# Altium schematic sheet Main.SchDoc: [Untitled]
size A3; Author: Nędzny Janusz; CompanyName: SensDx S.A.; Organization: SensDx S.A.; Address1: Wrocław Laboratories; SheetNumber: 1; SheetTotal: 1
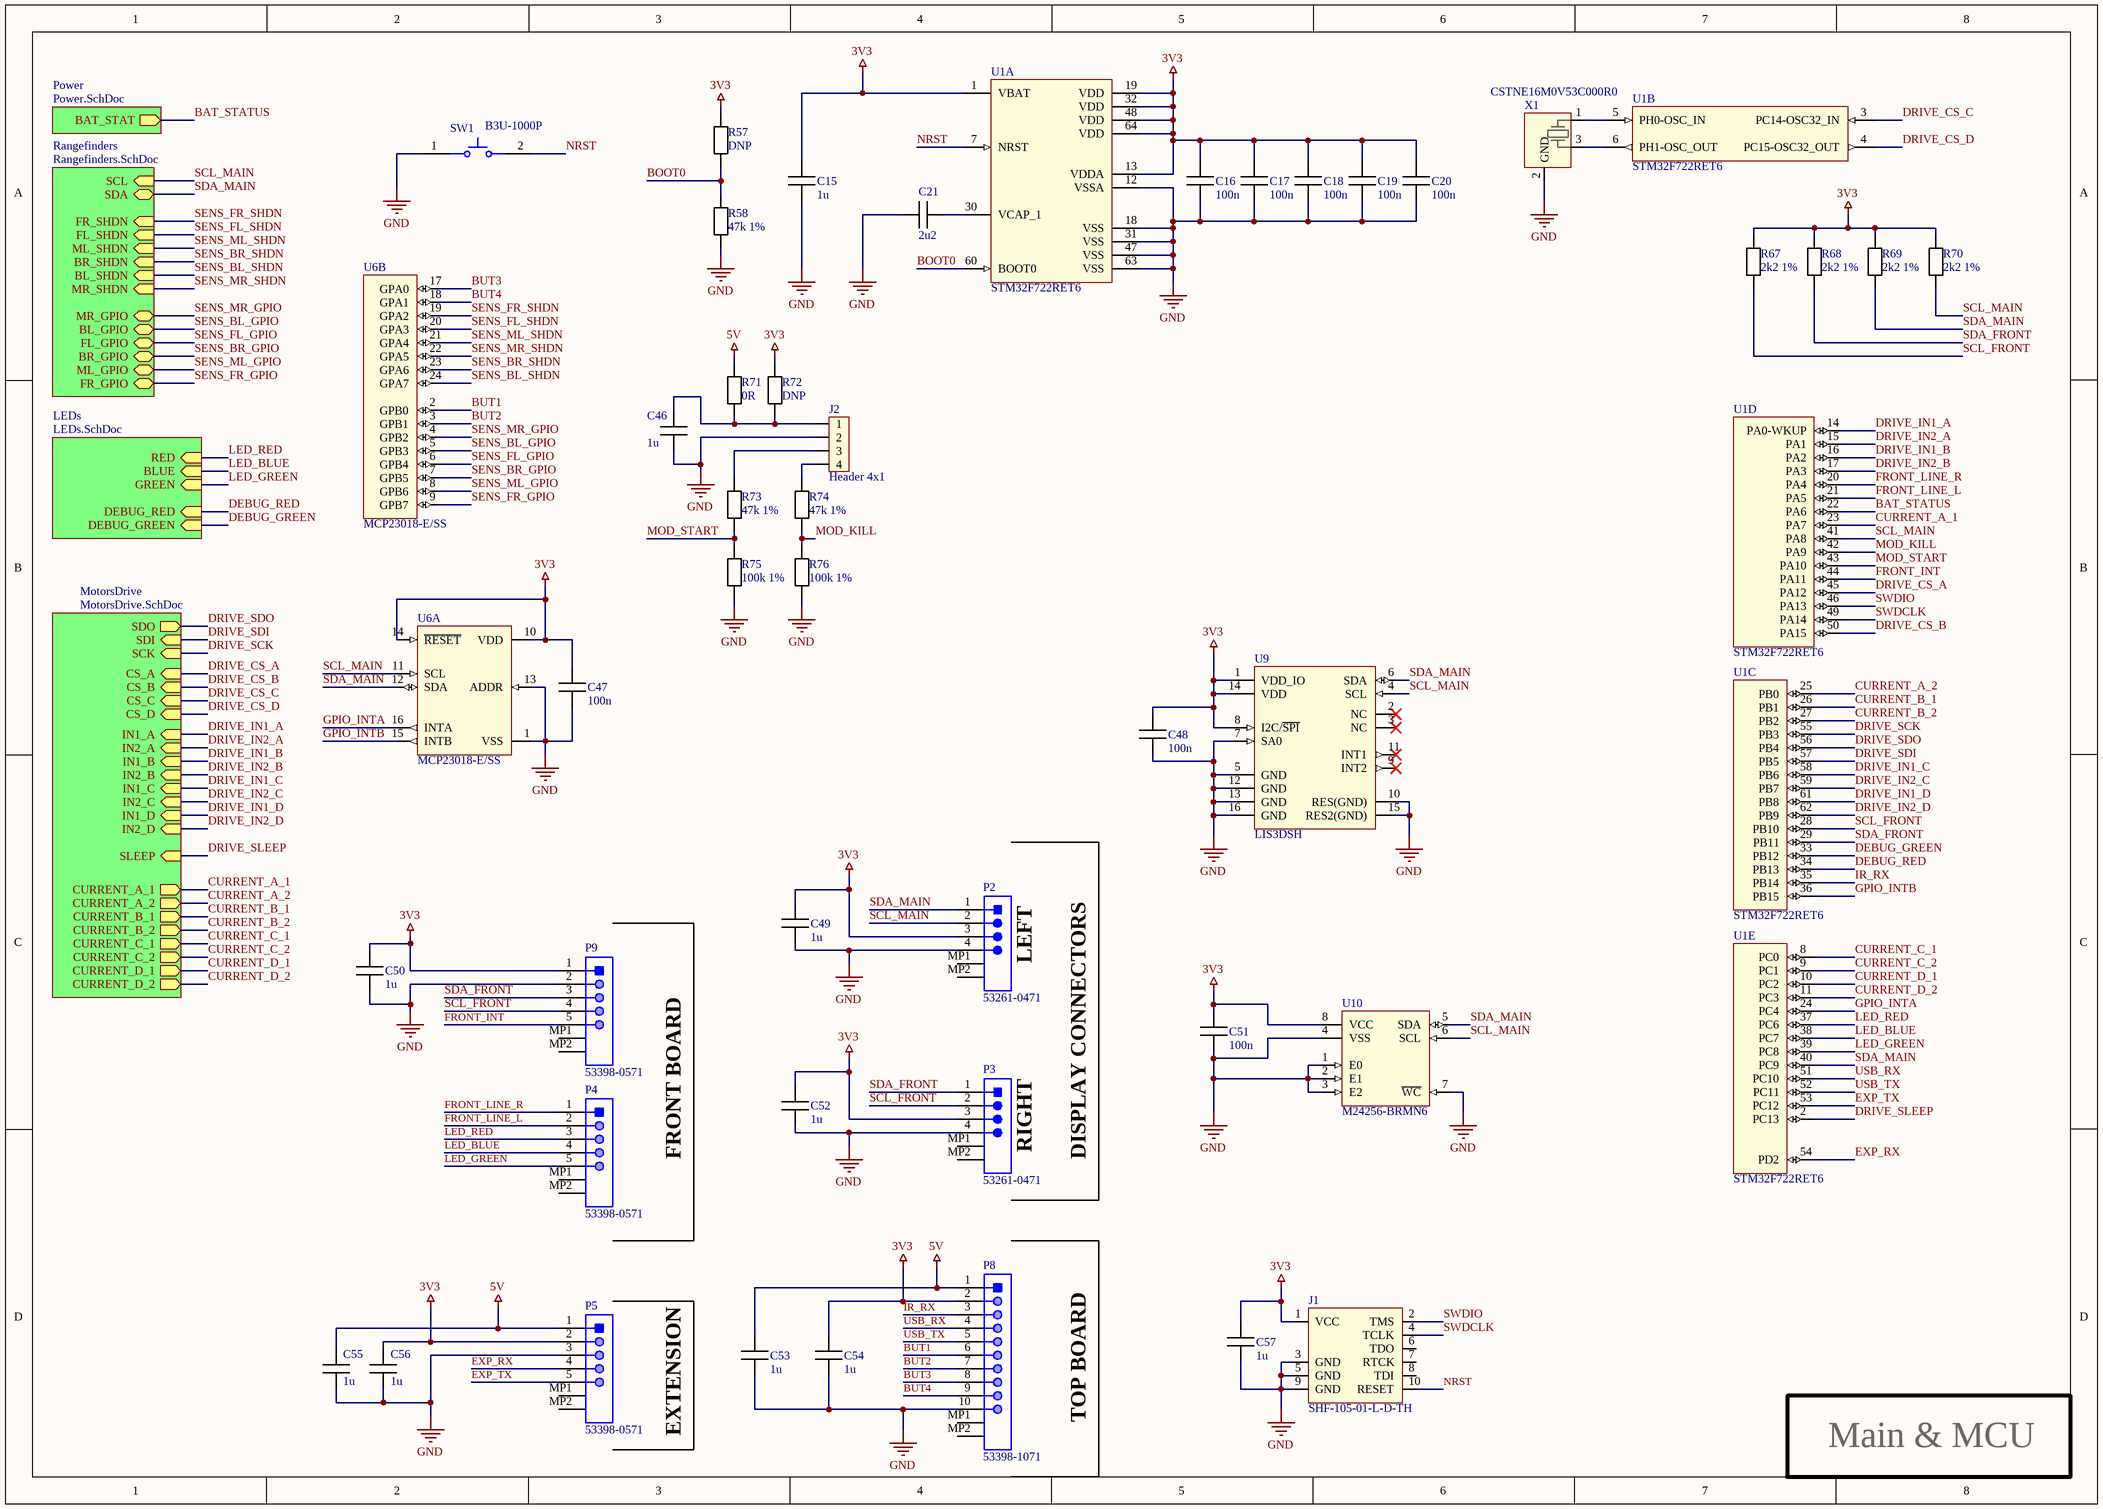
[diagram p0: Main.SchDoc]

## Parts
C15  1u  [C_0603_AUTO]
C16  100n  [C_0603_AUTO]
C17  100n  [C_0603_AUTO]
C18  100n  [C_0603_AUTO]
C19  100n  [C_0603_AUTO]
C20  100n  [C_0603_AUTO]
C21  2u2  [C_0603_AUTO]
C46  1u  [C_0603_AUTO]
C47  100n  [C_0603_AUTO]
C48  100n  [C_0603_AUTO]
C49  1u  [C_0603_AUTO]
C50  1u  [C_0603_AUTO]
C51  100n  [C_0603_AUTO]
C52  1u  [C_0603_AUTO]
C53  1u  [C_0603_AUTO]
C54  1u  [C_0603_AUTO]
C55  1u  [C_0603_AUTO]
C56  1u  [C_0603_AUTO]
C57  1u  [C_0603_AUTO]
J1  SHF-105-01-L-D-TH  [SHF-105-01-L-D-TH]
J2  Header 4x1  [F_4X1_254]
P2  53261-0471  [MOLEX-53261-0471_V]
P3  53261-0471  [MOLEX-53261-0471_V]
P4  53398-0571  [MOLX-53398-0571-5_V]
P5  53398-0571  [MOLX-53398-0571-5_V]
P8  53398-1071  [MOLX-53398-1071_V]
P9  53398-0571  [MOLX-53398-0571-5_V]
R57  DNP  [R_0603_AUTO]
R58  47k 1%  [R_0603_AUTO]
R67  2k2 1%  [R_0603_AUTO]
R68  2k2 1%  [R_0603_AUTO]
R69  2k2 1%  [R_0603_AUTO]
R70  2k2 1%  [R_0603_AUTO]
R71  0R  [R_0603_AUTO]
R72  DNP  [R_0603_AUTO]
R73  47k 1%  [R_0603_AUTO]
R74  47k 1%  [R_0603_AUTO]
R75  100k 1%  [R_0603_AUTO]
R76  100k 1%  [R_0603_AUTO]
SW1  B3U-1000P  [OMRON-B3U-1000_V]
U1  STM32F722RET6  [LQFP_64_HAND]  (parts A,B,C,D,E of 5)
U6  MCP23018-E/SS  [SSOP-24_HAND]  (parts A,B of 2)
U9  LIS3DSH  [LGA16_AUTO]
U10  M24256-BRMN6  [SOIC_8_AUTO]
X1  CSTNE16M0V53C000R0  [Murata_CSTCE]

## Sub-sheets
LEDs = LEDs.SchDoc: RED (in), BLUE (in), GREEN (in), DEBUG_RED (in), DEBUG_GREEN (in)
MotorsDrive = MotorsDrive.SchDoc: IN1_C (in), IN2_D (in), SLEEP (in), IN2_B (in), IN1_D (in), SDO (out), SCK (in), CS_D (in), SDI (in), CS_C (in), IN2_A (in), IN1_A (in), IN1_B (in), CS_B (in), IN2_C (in), CS_A (in), CURRENT_D_2 (out), CURRENT_D_1 (out), CURRENT_C_1 (out), CURRENT_B_2 (out), CURRENT_C_2 (out), CURRENT_A_2 (out), CURRENT_A_1 (out), CURRENT_B_1 (out)
Power = Power.SchDoc: BAT_STAT (out)
Rangefinders = Rangefinders.SchDoc: FR_SHDN (in), FR_GPIO (bidir), SCL (in), FL_SHDN (in), SDA (bidir), BL_GPIO (bidir), MR_GPIO (bidir), FL_GPIO (bidir), ML_SHDN (in), BR_SHDN (in), BR_GPIO (bidir), BL_SHDN (in), ML_GPIO (bidir), MR_SHDN (in)

## Nets
3V3: C15.2 C16.2 C17.2 C18.2 C19.2 C20.2 C47.2 C48.2 C49.2 C50.2 C51.2 C52.2 C54.2 C56.2 C57.2 J1.1(VCC) P2.3 P3.3 P5.2 P8.2 P9.1 R57.2 R67.2 R68.2 R69.2 R70.2 R72.2 U1.1(VBAT) U1.13(VDDA) U1.19(VDD) U1.32(VDD) U1.48(VDD) U1.64(VDD) U6.10(VDD) U6.14(~{RESET}) U9.1(VDD_IO) U9.8(I2C/~{SPI}) U9.14(VDD) U10.8(VCC)
5V: C53.2 C55.2 P5.1 P8.1 R71.2
GND: C15.1 C16.1 C17.1 C18.1 C19.1 C20.1 C21.2 C46.1 C47.1 C48.1 C49.1 C50.1 C51.1 C52.1 C53.1 C54.1 C55.1 C56.1 C57.1 J1.3(GND) J1.5(GND) J1.9(GND) J2.2 P2.4 P3.4 P5.3 P8.10 P9.2 R58.1 R75.1 R76.1 SW1.1 U1.12(VSSA) U1.18(VSS) U1.31(VSS) U1.47(VSS) U1.63(VSS) U6.1(VSS) U6.13(ADDR) U9.5(GND) U9.7(SA0) U9.10(RES(GND)) U9.12(GND) U9.13(GND) U9.15(RES2(GND)) U9.16(GND) U10.1(E0) U10.2(E1) U10.3(E2) U10.4(VSS) U10.7(~{WC}) X1.2(GND)
BAT_STATUS: U1.22(PA6) ; sheet Power/BAT_STAT
BOOT0: R57.1 R58.2 U1.60(BOOT0)
BUT1: P8.6 U6.2(GPB0)
BUT2: P8.7 U6.3(GPB1)
BUT3: P8.8 U6.17(GPA0)
BUT4: P8.9 U6.18(GPA1)
CURRENT_A_1: U1.23(PA7) ; sheet MotorsDrive/CURRENT_A_1
CURRENT_A_2: U1.25(PB0) ; sheet MotorsDrive/CURRENT_A_2
CURRENT_B_1: U1.26(PB1) ; sheet MotorsDrive/CURRENT_B_1
CURRENT_B_2: U1.27(PB2) ; sheet MotorsDrive/CURRENT_B_2
CURRENT_C_1: U1.8(PC0) ; sheet MotorsDrive/CURRENT_C_1
CURRENT_C_2: U1.9(PC1) ; sheet MotorsDrive/CURRENT_C_2
CURRENT_D_1: U1.10(PC2) ; sheet MotorsDrive/CURRENT_D_1
CURRENT_D_2: U1.11(PC3) ; sheet MotorsDrive/CURRENT_D_2
DEBUG_GREEN: U1.33(PB12) ; sheet LEDs/DEBUG_GREEN
DEBUG_RED: U1.34(PB13) ; sheet LEDs/DEBUG_RED
DRIVE_CS_A: U1.45(PA12) ; sheet MotorsDrive/CS_A
DRIVE_CS_B: U1.50(PA15) ; sheet MotorsDrive/CS_B
DRIVE_CS_C: U1.3(PC14-OSC32_IN) ; sheet MotorsDrive/CS_C
DRIVE_CS_D: U1.4(PC15-OSC32_OUT) ; sheet MotorsDrive/CS_D
DRIVE_IN1_A: U1.14(PA0-WKUP) ; sheet MotorsDrive/IN1_A
DRIVE_IN1_B: U1.16(PA2) ; sheet MotorsDrive/IN1_B
DRIVE_IN1_C: U1.58(PB6) ; sheet MotorsDrive/IN1_C
DRIVE_IN1_D: U1.61(PB8) ; sheet MotorsDrive/IN1_D
DRIVE_IN2_A: U1.15(PA1) ; sheet MotorsDrive/IN2_A
DRIVE_IN2_B: U1.17(PA3) ; sheet MotorsDrive/IN2_B
DRIVE_IN2_C: U1.59(PB7) ; sheet MotorsDrive/IN2_C
DRIVE_IN2_D: U1.62(PB9) ; sheet MotorsDrive/IN2_D
DRIVE_SCK: U1.55(PB3) ; sheet MotorsDrive/SCK
DRIVE_SDI: U1.57(PB5) ; sheet MotorsDrive/SDI
DRIVE_SDO: U1.56(PB4) ; sheet MotorsDrive/SDO
DRIVE_SLEEP: U1.2(PC13) ; sheet MotorsDrive/SLEEP
EXP_RX: P5.4 U1.54(PD2)
EXP_TX: P5.5 U1.53(PC12)
FRONT_INT: P9.5 U1.44(PA11)
FRONT_LINE_L: P4.2 U1.21(PA5)
FRONT_LINE_R: P4.1 U1.20(PA4)
GPIO_INTA: U1.24(PC4) U6.16(INTA)
GPIO_INTB: U1.36(PB15) U6.15(INTB)
IR_RX: P8.3 U1.35(PB14)
LED_BLUE: P4.4 U1.38(PC7) ; sheet LEDs/BLUE
LED_GREEN: P4.5 U1.39(PC8) ; sheet LEDs/GREEN
LED_RED: P4.3 U1.37(PC6) ; sheet LEDs/RED
MOD_KILL: R74.1 R76.2 U1.42(PA9)
MOD_START: R73.1 R75.2 U1.43(PA10)
NRST: J1.10(RESET) SW1.2 U1.7(NRST)
SCL_FRONT: P3.2 P9.4 R67.1 U1.28(PB10)
SCL_MAIN: P2.2 R70.1 U1.41(PA8) U6.11(SCL) U9.4(SCL) U10.6(SCL) ; sheet Rangefinders/SCL
SDA_FRONT: P3.1 P9.3 R68.1 U1.29(PB11)
SDA_MAIN: P2.1 R69.1 U1.40(PC9) U6.12(SDA) U9.6(SDA) U10.5(SDA) ; sheet Rangefinders/SDA
SENS_BL_GPIO: U6.5(GPB3) ; sheet Rangefinders/BL_GPIO
SENS_BL_SHDN: U6.24(GPA7) ; sheet Rangefinders/BL_SHDN
SENS_BR_GPIO: U6.7(GPB5) ; sheet Rangefinders/BR_GPIO
SENS_BR_SHDN: U6.23(GPA6) ; sheet Rangefinders/BR_SHDN
SENS_FL_GPIO: U6.6(GPB4) ; sheet Rangefinders/FL_GPIO
SENS_FL_SHDN: U6.20(GPA3) ; sheet Rangefinders/FL_SHDN
SENS_FR_GPIO: U6.9(GPB7) ; sheet Rangefinders/FR_GPIO
SENS_FR_SHDN: U6.19(GPA2) ; sheet Rangefinders/FR_SHDN
SENS_ML_GPIO: U6.8(GPB6) ; sheet Rangefinders/ML_GPIO
SENS_ML_SHDN: U6.21(GPA4) ; sheet Rangefinders/ML_SHDN
SENS_MR_GPIO: U6.4(GPB2) ; sheet Rangefinders/MR_GPIO
SENS_MR_SHDN: U6.22(GPA5) ; sheet Rangefinders/MR_SHDN
SWDCLK: J1.4(TCLK) U1.49(PA14)
SWDIO: J1.2(TMS) U1.46(PA13)
USB_RX: P8.4 U1.51(PC10)
USB_TX: P8.5 U1.52(PC11)
NetC21_1: C21.1 U1.30(VCAP_1)
NetC46_2: C46.2 J2.1 R71.1 R72.1
NetJ2_3: J2.3 R73.2
NetJ2_4: J2.4 R74.2
NetU1_5: U1.5(PH0-OSC_IN) X1.1
NetU1_6: U1.6(PH1-OSC_OUT) X1.3

Not connected (* = marked no-connect by the designer): J1 6(TDO) 7(RTCK) 8(TDI); P2 MP1 MP2; P3 MP1 MP2; P4 MP1 MP2; P5 MP1 MP2; P8 MP1 MP2; P9 MP1 MP2; U9 2(NC)* 3(NC)* 9(INT2)* 11(INT1)*

## Notes on the sheet
- (near P2) LEFT
- FRONT BOARD
- (near P3) RIGHT
- DISPLAY CONNECTORS
- EXTENSION
- TOP BOARD
- Main & MCU
- Title
- Size:
- Date:
- A3
- Number:
- Time:
- Revision:
- Sheet
- of
- File:

## Library data of the parts
C15-C21 C46-C57 = Capacitor: Manufacturer: [Generic]; MPN: [Generic]
  C15 C46 C49 C50 C52-C57: Value: 1u
  C16-C20 C47 C48 C51: Value: 100n
  C21: Value: 2u2
J1 = JTAG_ARM_MINI_10_PIN: Standard ARM 20 pin JTAG connector. Angle 90 deg.; Manufacturer: Samtec; Value: NA; MPN: SHF-105-01-L-D-TH; Supplier 1: Farnell; Supplier 2: Mouser; Supplier 3: Digi-Key; Supplier Part Number 1: 2308450; Supplier Part Number 2: 200-SHF10501LDTH; Supplier Part Number 3: SHF-105-01-L-D-TH-ND
J2 = Header 4x1: Manufacturer: NA; Value: NA; MPN: NA
P2 P3 = CMP-2000-05238-1: Male Header, Pitch 1.25 mm, 1 x 4 Position, Height 3.4 mm, -40 to 85 degC, RoHS, Tape and Reel; Current Rating: 1A; Brand: Molex; Number of Positions / Contacts: 4; Pitch: 1.25mm; Voltage Rating: 125V; Mounting Angle: Right; Manufacturer URL: http://www.molex.com/; Factory Pack Quantity: 1000; Housing Material: Thermoplastic; Datasheet URL: http://www.molex.com/pdm_docs/sd/532610471_sd.pdf; Tradename: PicoBlade; Product Type: Headers; Contact Plating: Tin; Contact Material: PhosphorBronze; Package Description: 1.25mm Pitch PicoBlade(TM) Header, Surface Mount, Right Angle, Lead-Free, 4 Circuits; Mounting Style: SMD/SMT; Manufacturer: Molex; Series: 53261; Packaging: Reel; Number of Rows: 1; RoHS: Details; Number of Positions: 4; Product Category: Headers&WireHousings; Datasheet Version: Rev. G, 01/2012; Type: Shrouded; Termination Style: SMD
P4 P5 P9 = CMP-2000-05250-1: Male Header, Pitch 1.25 mm, 1 x 5 Postion, Height 4.7 mm, -40 to 85 degC, RoHS, Tape and Reel; Brand: Molex; Number of Positions: 5Position; Mounting Angle: Vertical; Current Rating: 1A; Pitch: 1.25mm; Voltage Rating: 125V; Type: Shrouded; Tradename: PicoBlade; Datasheet Version: Rev. E, 04/2006; Housing Material: Nylon; Datasheet URL: http://www.molex.com/pdm_docs/sd/533980571_sd.pdf; Termination Style: SMD; Contact Gender: Pin(Male); Factory Pack Quantity: 1000; Number of Rows: 1Row; Product: Headers; Package Reference: MOLX-53398-0571-5; Contact Material: PhosphorBronze; RoHS: Details; Manufacturer URL: http://www.molex.com/; Product Category: Headers&WireHousings; Contact Plating: Tin; Manufacturer: Molex; Series: 53398; Packaging: Reel; Mounting Style: SMD
P8 = CMP-2000-05635-1: Male Header, Pitch 1.25 mm, 1 x 10 Position, Height 4.7 mm, -40 to 85 degC, RoHS, Tape and Reel; Manufacturer: Molex; Mounting Angle: Vertical; Pitch: 1.25mm; Voltage Rating: 125V; Current Rating: 1A; Number of Rows: 1Row; Housing Material: Nylon; Mounting Technology: SurfaceMount; Mounting Style: SMD; Contact Material: PhosphorBronze; Product: Headers; Datasheet URL: http://www.molex.com/pdm_docs/sd/533981071_sd.pdf; Manufacturer URL: http://www.molex.com/; Datasheet Version: Rev. J, 09/2015; Factory Pack Quantity: 1000; Brand: Molex; Packaging: Reel; Product Category: Headers&WireHousings; Contact Gender: Pin(Male); Number of Positions: 10Position; RoHS: Details; Contact Plating: Tin; Package Description: Male Header, Pitch 1.25 mm, 1 x 10 Position, Height 4.7 mm; Series: 53398; Type: Shrouded; Package Reference: 53398-1071; Tradename: PicoBlade; Termination Style: SMD
R57 R58 R67-R76 = Resistor: MPN: [Generic]; Manufacturer: [Generic]
  R57 R72: Value: DNP
  R58 R73 R74: Value: 47k 1%
  R67-R70: Value: 2k2 1%
  R71: Value: 0R
  R75 R76: Value: 100k 1%
SW1 = CMP-2100-03586-1: Ultra-Small Tactile Switch, 0.05 A, 12 V, -25 to 70 degC, 2-Pin SMD, RoHS, Tape and Reel; Manufacturer: Omron Electronic Components; Operating Force: 1.5N; Current Rating: 50mA; Voltage Rating (DC): 12V; Electrical Life: 200000Cycles; Actuator Length: 0.4mm; Insulation Resistance: 100MOhm; Switch Travel: 0.15mm; Throw Configuration: SPST; Illumination Type: Illuminated; Width: 3mm; Weight: 0.022g; Datasheet Version: 42005.0; Datasheet URL: http://www.omron.com/ecb/products/pdf/en-b3u.pdf; Height: 1.2mm; Package Quantity: 1; REACH SVHC: Unknown; Contact Current Rating: 50mA; Contact Material: Silver; Max Current Rating: 50mA; Package Reference: B3U-1000; Termination: SMD/SMT; Packaging: TapeandReel; Manufacturer URL: http://www.omron.com/; RoHSCompliant: true; Mount: SurfaceMount; Length: 4mm; Min Operating Temperature: -25degC; Depth: 2.5mm; Lead Free: LeadFree; Case/Package: SMD/SMT; Package Description: 2-Pin Surface Mount Device, Body 3 x 2.5 mm; Max Operating Temperature: 70degC; Orientation: Straight
U1 = STM32F722RET6: ST 32-bit MCU, 64-pin package; Manufacturer: STMicroelectronics; Value: NA; MPN: STM32F722RET6; ComponentLink1Description: Datasheet; ComponentLink1URL: https://www.st.com/resource/en/datasheet/stm32f722re.pdf; ComponentLink4Description: Product page; ComponentLink4URL: https://www.st.com/en/microcontrollers/stm32f722re.html; Supplier 3: Digi-Key; Supplier 2: Mouser; Supplier 1: Farnell; Supplier Part Number 1: 2725144; Supplier Part Number 2: 511-STM32F722RET6; Supplier Part Number 3: 497-17184-ND
U6 = MCP23018-E/SS: Expander I/O, 16-bit, 3.4 MHz, I2C, 1.8 V, 5.5 V, SSOP24; Manufacturer: Microchip; Value: NA; MPN: MCP23018-E/SS; ComponentLink1Description: Datasheet; ComponentLink1URL: http://ww1.microchip.com/downloads/en/DeviceDoc/22103a.pdf; ComponentLink2Description: Product page; ComponentLink2URL: https://www.microchip.com/wwwproducts/en/MCP23018
U9 = LIS3DSH: MEMS digital output motion sensor: / ultra-low-power high-performance three-axis "nano" accelerometer; Manufacturer: STMicroelectronics; Value: NA; MPN: LIS3DSH; ComponentLink1Description: Datasheet; ComponentLink1URL: https://www.st.com/resource/en/datasheet/lis3dsh.pdf; Supplier 1: Farnell; Supplier 2: Digi-Key; Supplier 3: Mouser; Supplier Part Number 1: 2433078; Supplier Part Number 3: 511-LIS3DSH; Supplier Part Number 2: LIS3DSH-ND
U10 = M24256-BRMN6: 256 Kbit Serial I2C Bus EEPROM; Manufacturer: STMicroelectronics; Value: 256kb; MPN: M24256-BRMN6; ComponentLink1Description: Datasheet; ComponentLink1URL: https://www.st.com/resource/en/datasheet/m24256-br.pdf; Supplier 1: Farnell; Supplier 2: Digi-Key; Supplier 3: Mouser; Supplier Part Number 1: 3130145RL; Supplier Part Number 2: 497-6348-2-ND; Supplier Part Number 3: 511-M24256-BRMN6TP
X1 = CSTNE16M0V53C000R0: 16MHz crystal resonator; Manufacturer: Murata; MPN: CSTNE16M0V53C000R0; Value: 16MHz; ComponentLink1Description: Datasheet; ComponentLink1URL: https://www.murata.com/en-global/products/productdata/8801162166302/SPEC-CSTNE16M0V53C000R0.pdf?1559743213000; Supplier 1: Mouser; Supplier 2: Digi-Key; Supplier Part Number 1: 81-CSTNE16M0V53C000R; Supplier Part Number 2: 490-17949-2-ND